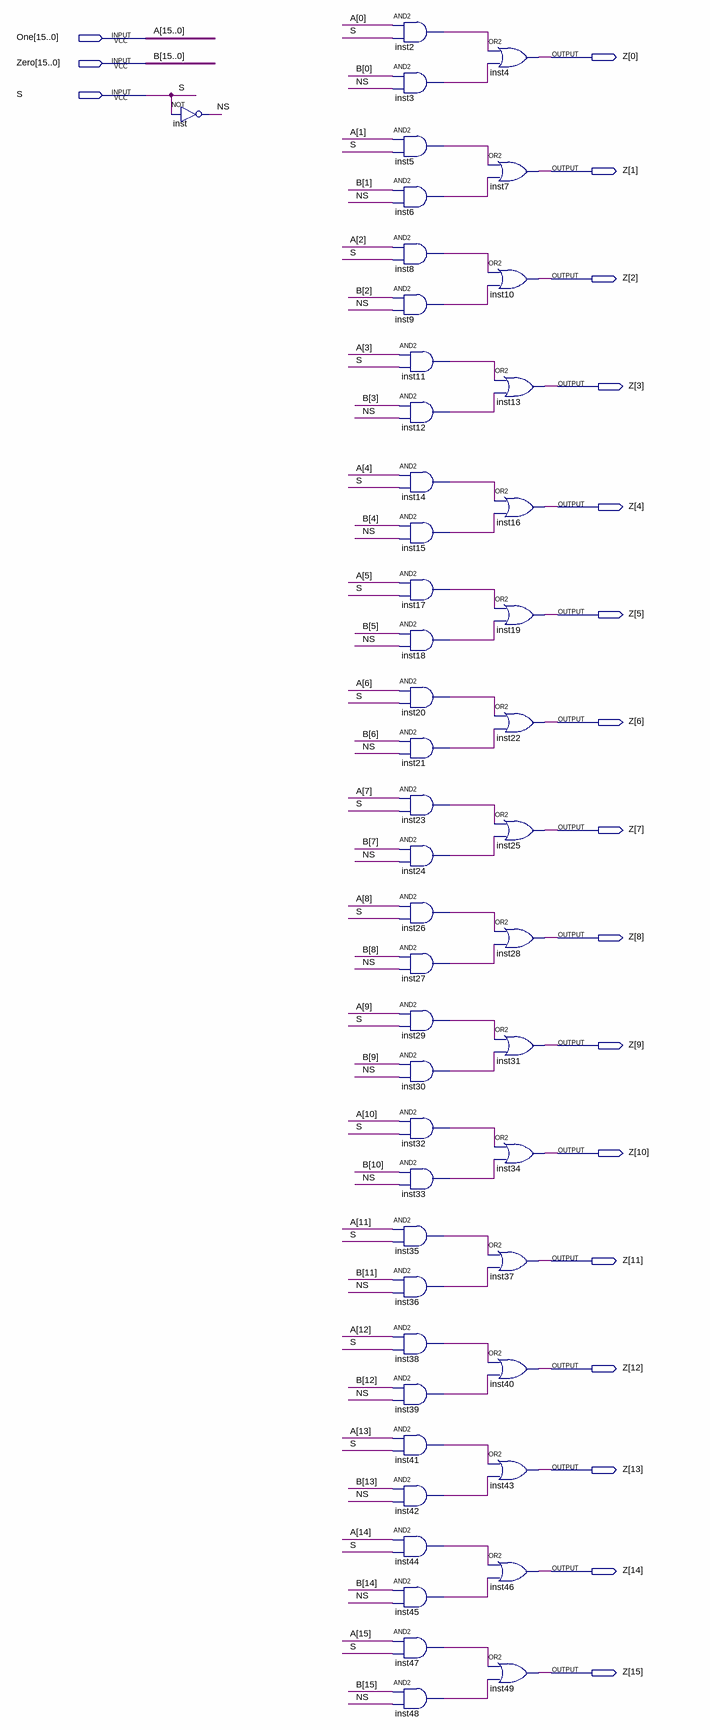
[diagram p0: schematic sheet]
// Quartus schematic SixteenTwoToOneMux.bdf as structural Verilog: 49 symbols, 19 pins
module SixteenTwoToOneMux (
  input  [15:0] One,
  input  [15:0] Zero,
  input  S,
  output [15:0] Z
);

  wire inst2_out, inst3_out, inst5_out, inst6_out, inst8_out, inst9_out, inst11_out, inst12_out, inst14_out,
       inst15_out, inst17_out, inst18_out, inst20_out, inst21_out, inst23_out, inst24_out, inst26_out,
       inst27_out, inst29_out, inst30_out, inst32_out, inst33_out, inst35_out, inst36_out, inst38_out,
       inst39_out, inst41_out, inst42_out, inst44_out, inst45_out, inst47_out, inst48_out, NS;

  not inst (NS, S);
  and inst2 (inst2_out, One[0], S);
  and inst3 (inst3_out, Zero[0], NS);
  and inst5 (inst5_out, One[1], S);
  and inst6 (inst6_out, Zero[1], NS);
  and inst8 (inst8_out, One[2], S);
  and inst9 (inst9_out, Zero[2], NS);
  and inst11 (inst11_out, One[3], S);
  and inst12 (inst12_out, Zero[3], NS);
  and inst14 (inst14_out, One[4], S);
  and inst15 (inst15_out, Zero[4], NS);
  and inst17 (inst17_out, One[5], S);
  and inst18 (inst18_out, Zero[5], NS);
  and inst20 (inst20_out, One[6], S);
  and inst21 (inst21_out, Zero[6], NS);
  and inst23 (inst23_out, One[7], S);
  and inst24 (inst24_out, Zero[7], NS);
  and inst26 (inst26_out, One[8], S);
  and inst27 (inst27_out, Zero[8], NS);
  and inst29 (inst29_out, One[9], S);
  and inst30 (inst30_out, Zero[9], NS);
  and inst32 (inst32_out, One[10], S);
  and inst33 (inst33_out, Zero[10], NS);
  and inst35 (inst35_out, One[11], S);
  and inst36 (inst36_out, Zero[11], NS);
  and inst38 (inst38_out, One[12], S);
  and inst39 (inst39_out, Zero[12], NS);
  and inst41 (inst41_out, One[13], S);
  and inst42 (inst42_out, Zero[13], NS);
  and inst44 (inst44_out, One[14], S);
  and inst45 (inst45_out, Zero[14], NS);
  and inst47 (inst47_out, One[15], S);
  and inst48 (inst48_out, Zero[15], NS);
  or inst4 (Z[0], inst2_out, inst3_out);
  or inst7 (Z[1], inst5_out, inst6_out);
  or inst10 (Z[2], inst8_out, inst9_out);
  or inst13 (Z[3], inst11_out, inst12_out);
  or inst16 (Z[4], inst14_out, inst15_out);
  or inst19 (Z[5], inst17_out, inst18_out);
  or inst22 (Z[6], inst20_out, inst21_out);
  or inst25 (Z[7], inst23_out, inst24_out);
  or inst28 (Z[8], inst26_out, inst27_out);
  or inst31 (Z[9], inst29_out, inst30_out);
  or inst34 (Z[10], inst32_out, inst33_out);
  or inst37 (Z[11], inst35_out, inst36_out);
  or inst40 (Z[12], inst38_out, inst39_out);
  or inst43 (Z[13], inst41_out, inst42_out);
  or inst46 (Z[14], inst44_out, inst45_out);
  or inst49 (Z[15], inst47_out, inst48_out);

  // Other names for the same wires on the sheet: A[15:0] = One; B[15:0] = Zero
endmodule
